# Altium schematic sheet bmsMaster_can.SchDoc
size A; SheetNumber: 6; SheetTotal: 7
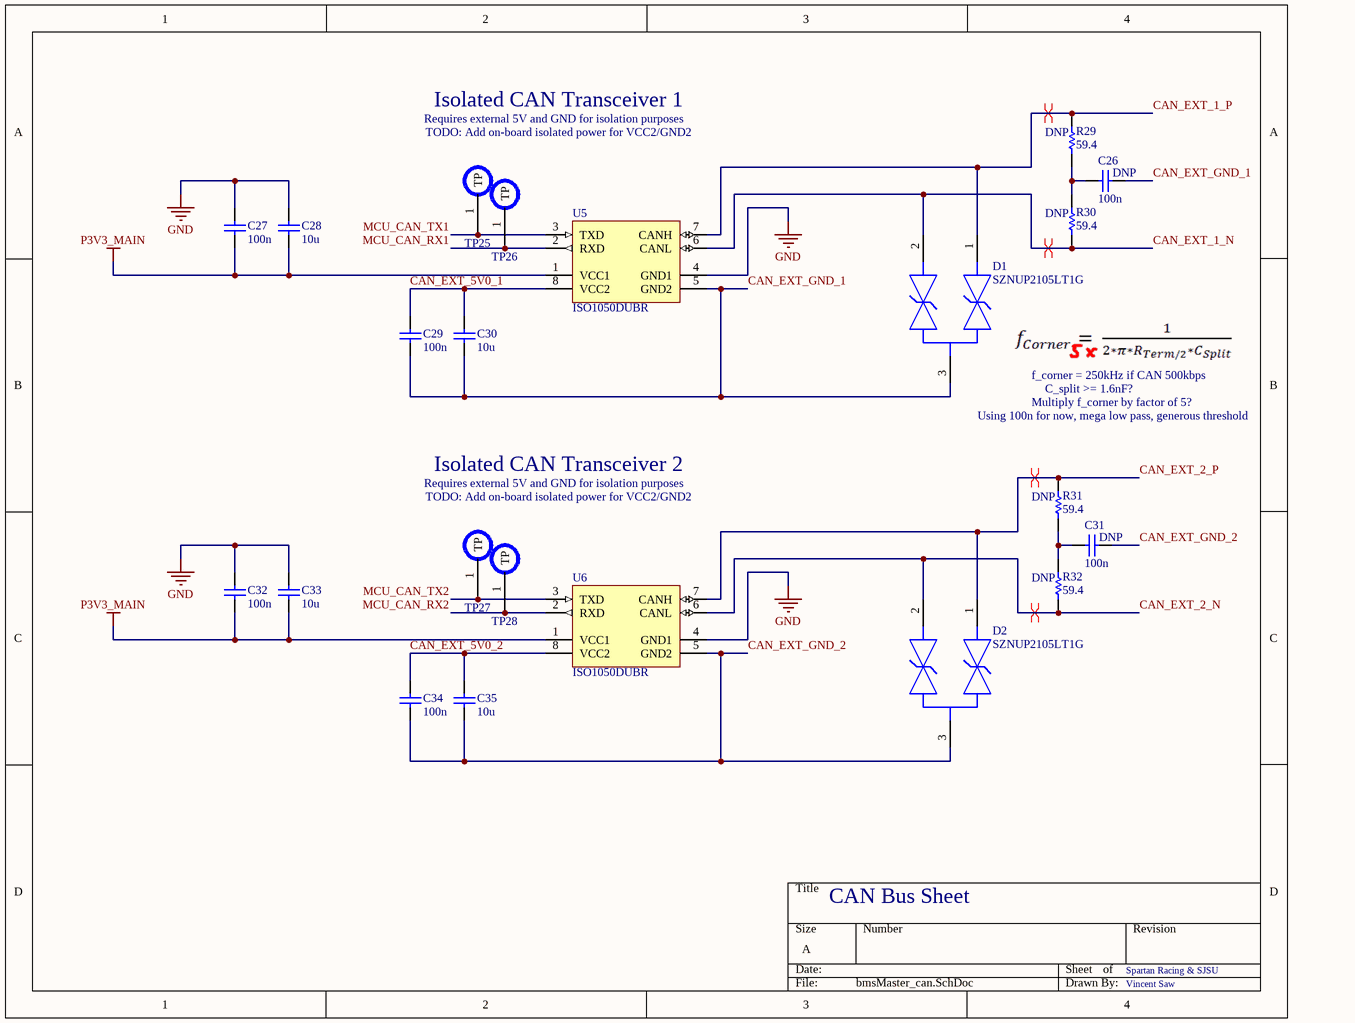
[diagram p0: bmsMaster_can.SchDoc]

## Parts
C26  value 100n  [CAPC1608X90N]  (hidden comment: Capacitor)
C27  value 100n  [CAPC1608X90N]  (hidden comment: Capacitor)
C28  value 10u  [CAPC1608X90N]  (hidden comment: Capacitor)
C29  value 100n  [CAPC1608X90N]  (hidden comment: Capacitor)
C30  value 10u  [CAPC1608X90N]  (hidden comment: Capacitor)
C31  value 100n  [CAPC1608X90N]  (hidden comment: Capacitor)
C32  value 100n  [CAPC1608X90N]  (hidden comment: Capacitor)
C33  value 10u  [CAPC1608X90N]  (hidden comment: Capacitor)
C34  value 100n  [CAPC1608X90N]  (hidden comment: Capacitor)
C35  value 10u  [CAPC1608X90N]  (hidden comment: Capacitor)
D1  SZNUP2105LT1G  [FP-318-08-MFG]
D2  SZNUP2105LT1G  [FP-318-08-MFG]
R29  value 59.4  [RESC1608X50N]  (hidden comment: Resistor)
R30  value 59.4  [RESC1608X50N]  (hidden comment: Resistor)
R31  value 59.4  [RESC1608X50N]  (hidden comment: Resistor)
R32  value 59.4  [RESC1608X50N]  (hidden comment: Resistor)
TP25  TSTPT  [Testpoint1]  (value not drawn)  (no BOM)
TP26  TSTPT  [Testpoint1]  (value not drawn)  (no BOM)
TP27  TSTPT  [Testpoint1]  (value not drawn)  (no BOM)
TP28  TSTPT  [Testpoint1]  (value not drawn)  (no BOM)
U5  ISO1050DUBR  [DUB0008A_L]
U6  ISO1050DUBR  [DUB0008A_L]

## Nets
GND: C27.2 C28.2 C32.2 C33.2 U5.4(GND1) U6.4(GND1)
P3V3_MAIN: C27.1 C28.1 C32.1 C33.1 U5.1(VCC1) U6.1(VCC1)
CAN_EXT_1_N: D1.2 R30.1 U5.6(CANL)
CAN_EXT_1_P: D1.1 R29.2 U5.7(CANH)
CAN_EXT_2_N: D2.2 R32.1 U6.6(CANL)
CAN_EXT_2_P: D2.1 R31.2 U6.7(CANH)
CAN_EXT_5V0_1: C29.2 C30.2 U5.8(VCC2)
CAN_EXT_5V0_2: C34.2 C35.2 U6.8(VCC2)
CAN_EXT_GND_1: C26.1 C29.1 C30.1 D1.3 U5.5(GND2)
CAN_EXT_GND_2: C31.1 C34.1 C35.1 D2.3 U6.5(GND2)
MCU_CAN_RX1: TP26.1(TP) U5.2(RXD)
MCU_CAN_RX2: TP28.1(TP) U6.2(RXD)
MCU_CAN_TX1: TP25.1(TP) U5.3(TXD)
MCU_CAN_TX2: TP27.1(TP) U6.3(TXD)
NetC26_2: C26.2 R29.1 R30.2
NetC31_2: C31.2 R31.1 R32.2

## Layout directives
differential pair: CAN_EXT_1_N, CAN_EXT_1_P, CAN_EXT_2_N, CAN_EXT_2_P

## Notes on the sheet
- Requires external 5V and GND for isolation purposes
- Isolated CAN Transceiver 1
- TODO: Add on-board isolated power for VCC2/GND2
- (near R29) DNP
- (near R30) DNP
- (near C26) DNP
- Using 100n for now, mega low pass, generous threshold
- f_corner = 250kHz if CAN 500kbps
- Multiply f_corner by factor of 5?
- C_split >= 1.6nF?
- Isolated CAN Transceiver 2
- (near R31) DNP
- (near C31) DNP
- (near R32) DNP
- CAN Bus Sheet
- Spartan Racing & SJSU
- Vincent Saw

## Library data of the parts
C26-C35 = Capacitor: SimulationGenericComponent: True
D1 D2 = CMP-1063-00167-2: TVS DIODE 24V 44V SOT23-3; Manufacturer: ON Semiconductor; Capacitance: 30pF; Max Junction Temp: +150°C; Breakdown Voltage: 26.2V; Number Of Channels: 2; Automotive Grade: Grade 0; Standoff Height: 0.01mm; Peak Pulse Current: 8A; Value: 30pF; Direction: Bidirectional; Peak Pulse Power: 350W; Octopart: https://octopart.com/sznup2105lt1g-on+semiconductor-22134626; Reverse Standoff Voltage: 24V; Digikey Description: TVS DIODE 24V 44V SOT23-3; RoHS: TRUE; Manufacturer Part Number: SZNUP2105LT1G; Height: 1.11mm; Automotive: Yes; ComponentLink2URL: https://www.onsemi.com/pub/Collateral/NUP2105L-D.PDF; Device Class L3: unset; Package: 318-08; Lead Free: Yes; Device Class L2: TVS Diodes; Footprint Url: https://www.onsemi.com/pub/Collateral/318-08.PDF; Temperature Range Low: -55°C; Device Class L1: Circuit Protection; Temperature: -55°C to +150°C; Temperature Range High: +150°C; Category: Diode; Clamping Voltage: 44V; ComponentLink2Description: Datasheet
R29-R32 = Resistor: TC1: 0; SimulationGenericComponent: True; TC2: 0
TP25-TP28 = Testpoint1
U5 U6 = CMP-0315-00093-2: Isolated CAN Transceiver, -55 to 105 degC, 8-pin SOP (DUB), Green (RoHS & no Sb/Br); Manufacturer: Texas Instruments; Rating: Catalog; Isolated: Yes; Drivers Per Package: 1; PackageReference: DUB0008A; PartNumber: ISO1050DUBR; ComponentLink2Description: Package Specification; ComponentLink1Description: Datasheet; Mounting Technology: Surface Mount; ComponentLink1URL: http://www.ti.com/general/docs/lit/getliterature.tsp?genericPartNumber=ISO1050&fileType=pdf; ComponentLink2URL: http://www.ti.com/litv/pdf/mpds247b; Eco-Plan: Green (RoHS & no Sb/Br); PackageDescription: 8-Pin Small Outline Package 2.54 mm Pitch; PackageVersion: revC, May-2006; SubFamily: CAN; DatasheetVersion: SLLS983E